# Altium schematic sheet Ethernet Phy.SchDoc
size B; SheetNumber: 11; SheetTotal: 14
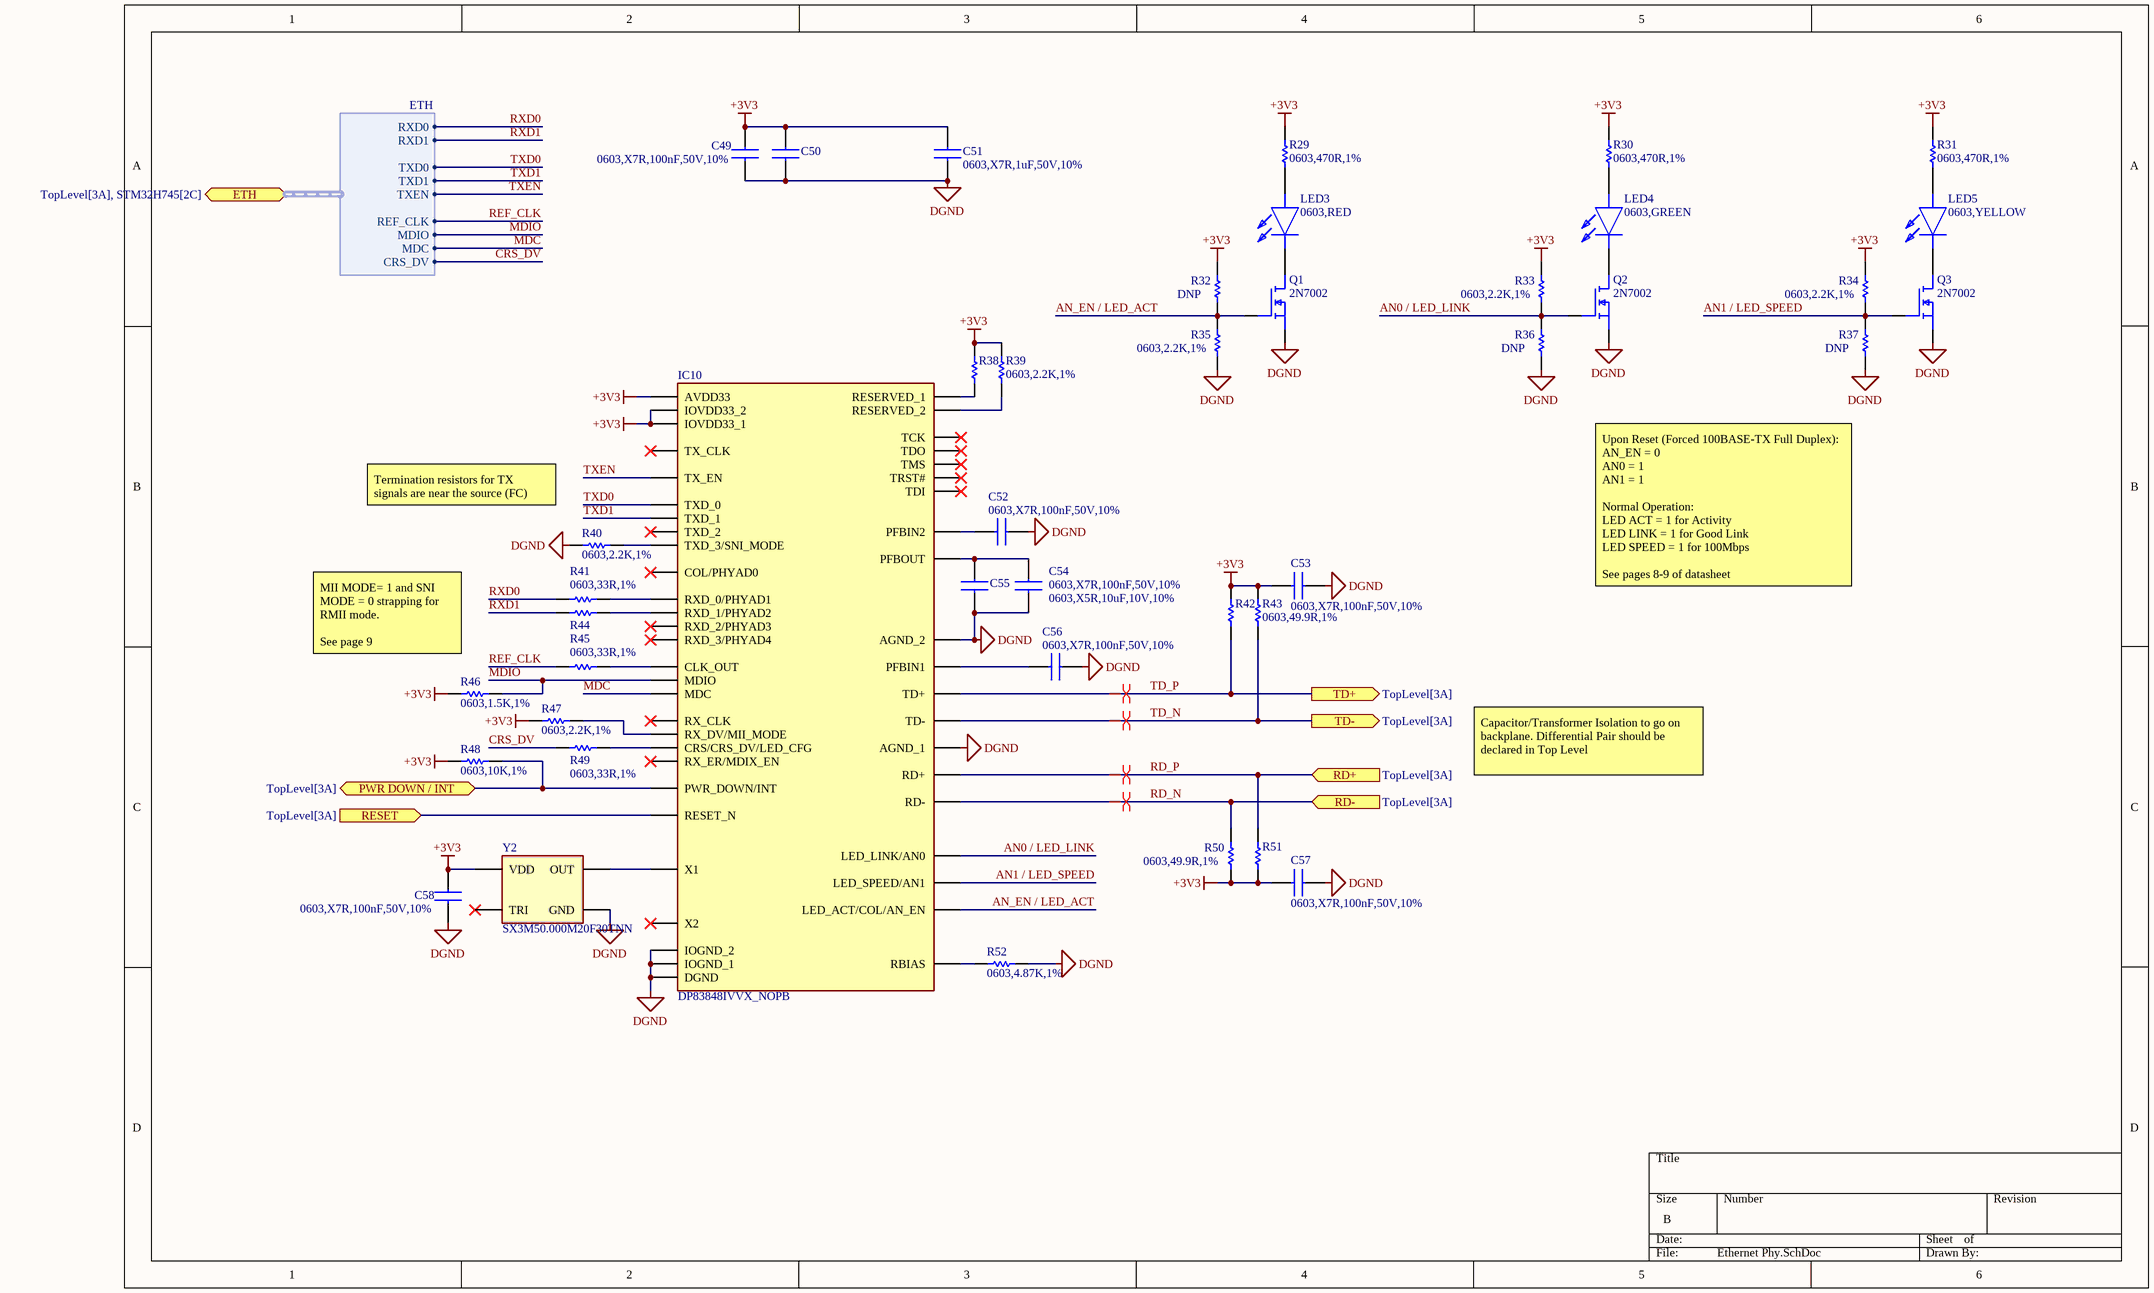
[diagram p0: Ethernet Phy.SchDoc]

## Parts
C49  0603,X7R,100nF,50V,10%  [CAPC1608X90N]
C50  0603,X7R,100nF,50V,10%  [CAPC1608X90N]  (value not drawn)
C51  0603,X7R,1uF,50V,10%  [CAPC1608X90N]
C52  0603,X7R,100nF,50V,10%  [CAPC1608X90N]
C53  0603,X7R,100nF,50V,10%  [CAPC1608X90N]
C54  0603,X7R,100nF,50V,10%  [CAPC1608X90N]
C55  0603,X5R,10uF,10V,10%  [CAPC1608X90N]
C56  0603,X7R,100nF,50V,10%  [CAPC1608X90N]
C57  0603,X7R,100nF,50V,10%  [CAPC1608X90N]
C58  0603,X7R,100nF,50V,10%  [CAPC1608X90N]
IC10  DP83848IVVX_NOPB  [QFP50P900X900X160-48N]
LED3  0603,RED  [LEDC1608X36N]
LED4  0603,GREEN  [LEDC1608X36N]
LED5  0603,YELLOW  [LEDC1608X36N]
Q1  2N7002  [SOT95P230X110-3N]
Q2  2N7002  [SOT95P230X110-3N]
Q3  2N7002  [SOT95P230X110-3N]
R29  0603,470R,1%  [RESC1608X90N]
R30  0603,470R,1%  [RESC1608X90N]
R31  0603,470R,1%  [RESC1608X90N]
R32  DNP  [RESC1608X90N]
R33  0603,2.2K,1%  [RESC1608X90N]
R34  0603,2.2K,1%  [RESC1608X90N]
R35  0603,2.2K,1%  [RESC1608X90N]
R36  DNP  [RESC1608X90N]
R37  DNP  [RESC1608X90N]
R38  0603,2.2K,1%  [RESC1608X90N]  (value not drawn)
R39  0603,2.2K,1%  [RESC1608X90N]
R40  0603,2.2K,1%  [RESC1608X90N]
R41  0603,33R,1%  [RESC1608X90N]
R42  0603,49.9R,1%  [RESC1608X90N]  (value not drawn)
R43  0603,49.9R,1%  [RESC1608X90N]
R44  0603,33R,1%  [RESC1608X90N]  (value not drawn)
R45  0603,33R,1%  [RESC1608X90N]
R46  0603,1.5K,1%  [RESC1608X90N]
R47  0603,2.2K,1%  [RESC1608X90N]
R48  0603,10K,1%  [RESC1608X90N]
R49  0603,33R,1%  [RESC1608X90N]
R50  0603,49.9R,1%  [RESC1608X90N]
R51  0603,49.9R,1%  [RESC1608X90N]  (value not drawn)
R52  0603,4.87K,1%  [RESC1608X55N]
Y2  SX3M50.000M20F30TNN  [SX3M50_000M20F30TNN]

## Ports
ETH (bidir, harness ETH, see TopLevel[3A], STM32H745[2C]), PWR DOWN / INT (bidir, see TopLevel[3A]), RD+ (in, see TopLevel[3A]), RD- (in, see TopLevel[3A]), RESET (in, see TopLevel[3A]), TD+ (out, see TopLevel[3A]), TD- (out, see TopLevel[3A])

## Harnesses
ETH: RXD0, RXD1, TXD0, TXD1, REF_CLK, MDIO, MDC, CRS_DV, TXEN

## Nets
+3V3: C49.2 C50.2 C51.2 C53.2 C57.2 C58.2 IC10.22(AVDD33) IC10.32(IOVDD33_1) IC10.48(IOVDD33_2) R29.2 R30.2 R31.2 R32.2 R33.2 R34.2 R38.2 R39.2 R42.2 R43.2 R46.1 R47.1 R48.1 R50.1 R51.1 Y2.4(VDD)
DGND: C49.1 C50.1 C51.1 C52.1 C53.1 C54.1 C55.1 C56.2 C57.1 C58.1 IC10.15(AGND_1) IC10.19(AGND_2) IC10.35(IOGND_1) IC10.36(DGND) IC10.47(IOGND_2) Q1.2(S) Q2.2(S) Q3.2(S) R35.1 R36.1 R37.1 R40.1 R52.2 Y2.2(GND)
AN0 / LED_LINK: IC10.28(LED_LINK/AN0) Q2.1(G) R33.1 R36.2
AN1 / LED_SPEED: IC10.27(LED_SPEED/AN1) Q3.1(G) R34.1 R37.2
AN_EN / LED_ACT: IC10.26(LED_ACT/COL/AN_EN) Q1.1(G) R32.1 R35.2
CRS_DV: R49.1 ; port ETH.CRS_DV
MDC: IC10.31(MDC) ; port ETH.MDC
MDIO: IC10.30(MDIO) R46.2 ; port ETH.MDIO
PWR DOWN / INT: IC10.7(PWR_DOWN/INT) R48.2 ; port PWR DOWN / INT
RD_N: IC10.13(RD-) R50.2 ; port RD-
RD_P: IC10.14(RD+) R51.2 ; port RD+
REF_CLK: R45.1 ; port ETH.REF_CLK
RESET: IC10.29(RESET_N) ; port RESET
RXD0: R41.1 ; port ETH.RXD0
RXD1: R44.1 ; port ETH.RXD1
TD_N: IC10.16(TD-) R43.1 ; port TD-
TD_P: IC10.17(TD+) R42.1 ; port TD+
TXD0: IC10.3(TXD_0) ; port ETH.TXD0
TXD1: IC10.4(TXD_1) ; port ETH.TXD1
TXEN: IC10.2(TX_EN) ; port ETH.TXEN
NetC52_2: C52.2 IC10.37(PFBIN2)
NetC54_2: C54.2 C55.2 IC10.23(PFBOUT)
NetC56_1: C56.1 IC10.18(PFBIN1)
NetIC10_6: IC10.6(TXD_3/SNI_MODE) R40.2
NetIC10_20: IC10.20(RESERVED_1) R38.1
NetIC10_21: IC10.21(RESERVED_2) R39.1
NetIC10_24: IC10.24(RBIAS) R52.1
NetIC10_25: IC10.25(CLK_OUT) R45.2
NetIC10_34: IC10.34(X1) Y2.3(OUT)
NetIC10_39: IC10.39(RX_DV/MII_MODE) R47.2
NetIC10_40: IC10.40(CRS/CRS_DV/LED_CFG) R49.2
NetIC10_43: IC10.43(RXD_0/PHYAD1) R41.2
NetIC10_44: IC10.44(RXD_1/PHYAD2) R44.2
NetLED3_1: LED3.1(K) Q1.3(D)
NetLED3_2: LED3.2(A) R29.1
NetLED4_1: LED4.1(K) Q2.3(D)
NetLED4_2: LED4.2(A) R30.1
NetLED5_1: LED5.1(K) Q3.3(D)
NetLED5_2: LED5.2(A) R31.1

Not connected (* = marked no-connect by the designer): IC10 1(TX_CLK)* 5(TXD_2)* 8(TCK)* 9(TDO)* 10(TMS)* 11(TRST#)* 12(TDI)* 33(X2)* 38(RX_CLK)* 41(RX_ER/MDIX_EN)* 42(COL/PHYAD0)* 45(RXD_2/PHYAD3)* 46(RXD_3/PHYAD4)*; Y2 1(TRI)*

## Layout directives
differential pair: RD_N, RD_P, TD_N, TD_P

## Notes on the sheet
- (near R40) Termination resistors for TX signals are near the source (FC)
- Upon Reset (Forced 100BASE-TX Full Duplex):
  AN_EN = 0
  AN0 = 1
  AN1 = 1
  Normal Operation:
  LED ACT = 1 for Activity
  LED LINK = 1 for Good Link
  LED SPEED = 1 for 100Mbps
  See pages 8-9 of datasheet
- (near R46) MII MODE= 1 and SNI MODE = 0 strapping for RMII mode.
  See page 9
- Capacitor/Transformer Isolation to go on backplane. Differential Pair should be declared in Top Level

## Library data of the parts
C49 C50 C52-C54 C56-C58 = CC0603KRX7R9BB104: 50V 100nF X7R ±10% 0603 Multilayer Ceramic Capacitors MLCC - SMD/SMT ROHS; LCSC Part #: C14663; Manu Part #: CC0603KRX7R9BB104
C51 = CL10A105KB8NNNC: 50V 1uF X7R ±10% 0603 Multilayer Ceramic Capacitors MLCC - SMD/SMT ROHS; LCSC Part #: C15849; Manu Part #: CL10A105KB8NNNC
C55 = CL10A106KP8NNNC: 10uF ±10% 10V Ceramic Capacitor X5R 0603; LCSC Part #: C19702; Manu Part #: CL10A106KP8NNNC
IC10 = DP83848IVVX_NOPB: Single Port 10/100 Mb/s Ethernet Physical Layer Transceiver; Manu Part #: DP83848IVVX/NOPB; LCSC Part #: C12082
LED3 = KT-0603R: -40℃~+85℃ 1.8V~2.4V 120° 20mA 300mcd 40mW 615nm~630nm 645nm Discrete Diode Red Water Clear 0603 LED Indication - Discrete ROHS; Manu Part #: KT-0603R; LCSC Part #: C2286
LED4 = SML-E12P8WT86: Green LED Indication - Discrete 2.2V 0603; Manu Part #: SML-E12P8WT86; LCSC Part #: C126319
LED5 = SML-D12Y1WT86: Yellow LED Indication - Discrete 2.2V 0603; Manu Part #: SML-D12Y1WT86; LCSC Part #: C253534
Q1-Q3 = 2N7002: N-Channel 60V 300mA 830mW Surface Mount SOT-23; Manu Part #: 2N7002; LCSC Part #: C8545
R29-R31 = 0603WAF4700T5E: -55℃~+155℃ 100mW 470Ω 75V Thick Film Resistor ±1% ±100ppm/℃ 0603 Chip Resistor - Surface Mount ROHS; LCSC Part #: C23179; Manu Part #: 0603WAF4700T5E
R32-R40 R47 = 0603WAF2201T5E: 2.2kΩ ±1% 100mW 0603 Thick Film Resistor; LCSC Part #: C4190; Manu Part #: 0603WAF2201T5E
R41 R44 R45 R49 = 0603WAF330JT5E: 100mW 33Ω 75V Thick Film Resistor ±100ppm/℃ ±1% 0603 Chip Resistor - Surface Mount RoHS; LCSC Part #: C23140; Manu Part #: 0603WAF330JT5E
R42 R43 R50 R51 = 0603WAF499JT5E: -55℃~+155℃ 100mW 49.9Ω 75V Thick Film Resistor ±1% ±100ppm/℃ 0603 Chip Resistor - Surface Mount ROHS; LCSC Part #: C23185; Manu Part #: 0603WAF499JT5E
R46 = 0603WAF1501T5E: 100mW 1.5kΩ 75V Thick Film Resistor ±100ppm/℃ ±1% 0603 Chip Resistor - Surface Mount RoHS; LCSC Part #: C22843; Manu Part #: 0603WAF1501T5E
R48 = 0603WAF1002T5E: 100mW Thick Film Resistor 75V ±100ppm/℃ ±1% 10kΩ 0603 Chip Resistor - Surface Mount ROHS; LCSC Part #: C25804; Manu Part #: 0603WAF1002T5E
R52 = RC0603FR-074K87L: 4.87kΩ 100mW 75V Thick Film Resistor ±100ppm/℃ ±1% 0603 Chip Resistor - Surface Mount RoHS; LCSC Part #: C137709; Manu Part #: RC0603FR-074K87L
Y2 = SX3M50.000M20F30TNN: Oscillator 50MHz ±20ppm CMOS 1.62V~3.63V SMD3225-4P; LCSC Part #: C2901592; Manu Part #: SX3M50.000M20F30TNN